# EasyEDA schematic MOSfet Switch.json
TITLE: MOSFet-Switch-B.01.00; REV: 1.0; Date: 2025-02-12; Sheet: 1/1; Drawn By: helmut-f; Company: Your Company
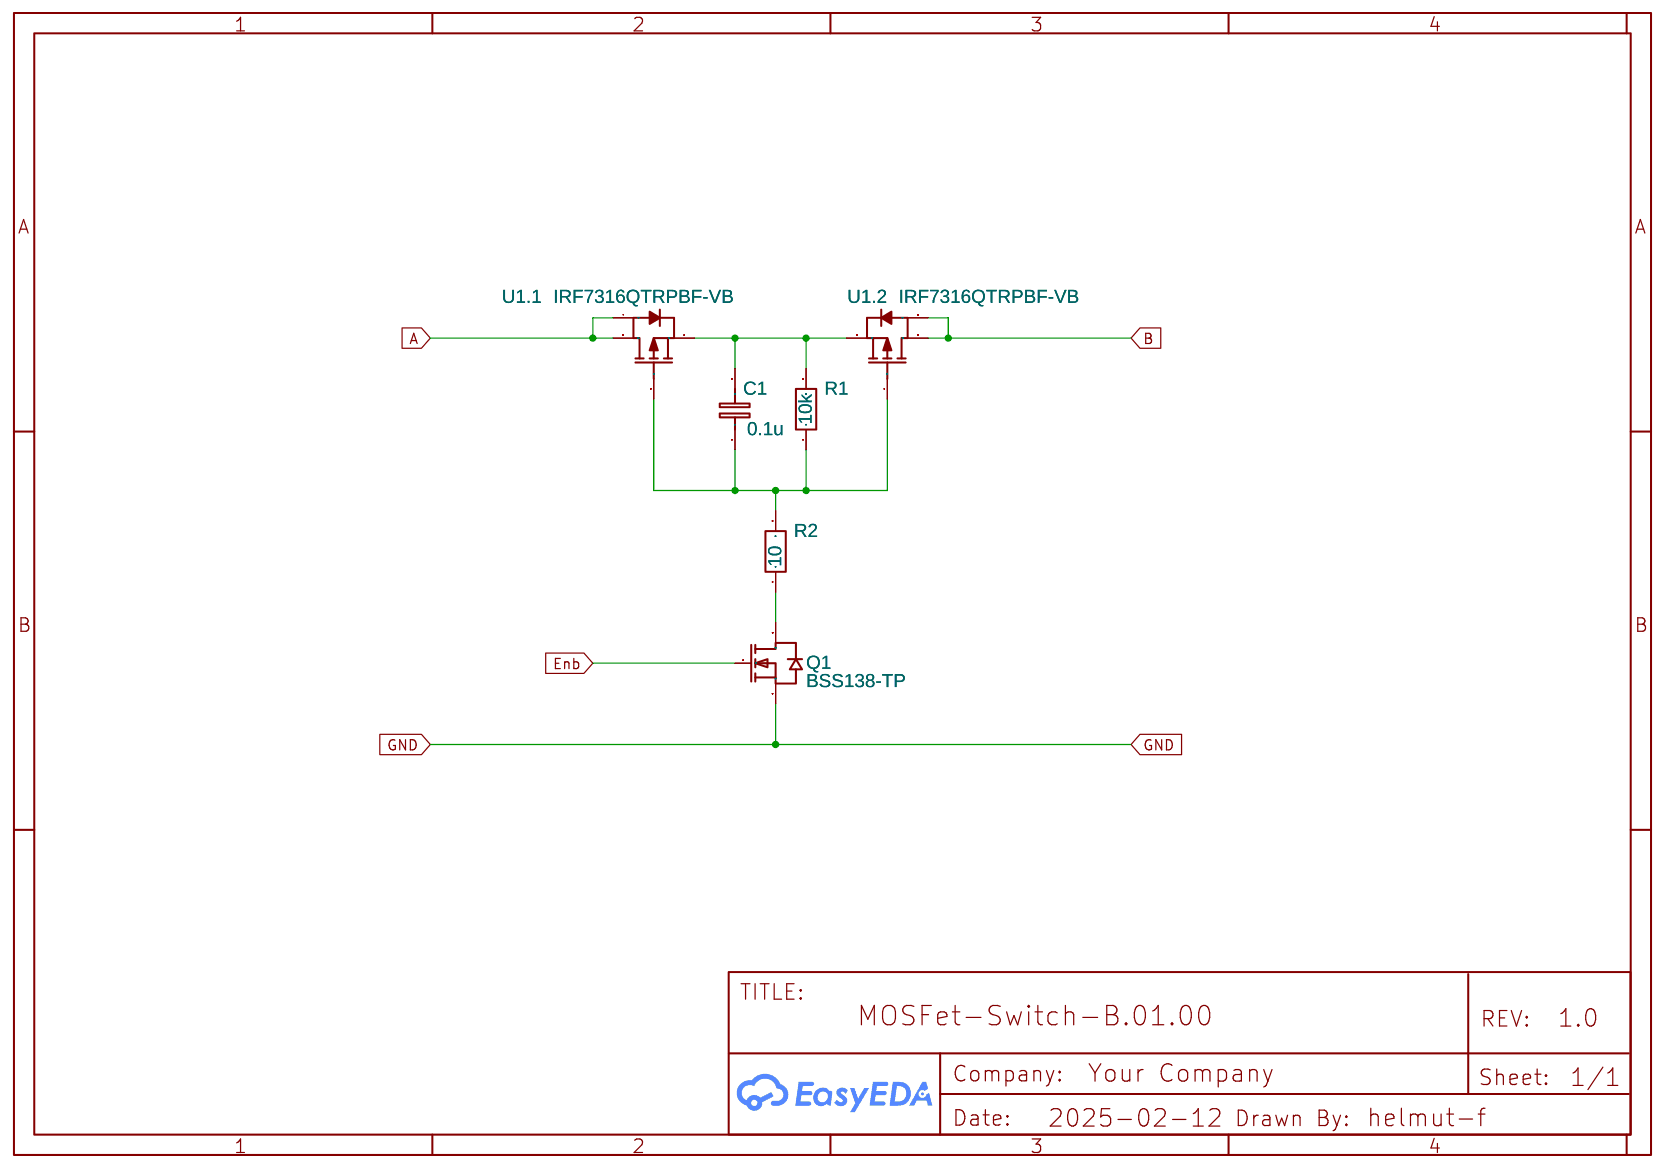
[diagram p0: schematic sheet]

## Parts
C1  0.1u  [C1206]
Q1  BSS138-TP  [SOT-23-3_L2.9-W1.3-P1.90-LS2.4-BR]
R1  10k  [R1206]
R2  10  [R1206]
U1  IRF7316QTRPBF-VB  [SOP-8_L4.9-W3.9-P1.27-LS6.0-BL]  (sections 1,2)

## Library data of the parts
C1 = C_1206_EU: Contributor: LCEDA_Lib
Q1 = BSS138-TP: Contributor: LCSC; Supplier: LCSC; Supplier Part: C435876; Manufacturer: MCC(美微科); JLCPCB Part Class: Extended Part
R1 R2 = R_1206_EU: Contributor: LCEDA_Lib
U1 = IRF7316QTRPBF-VB: Supplier: LCSC; Supplier Part: C18795001; Manufacturer: VBsemi(微碧半导体); subpart_no: 1; JLCPCB Part Class: Extended Part

## Nets
GND: Q1.2(S)
A: U1.7(D1) U1.8(D1)
B: U1.5(D2) U1.6(D2)
Enb: Q1.1(G)
Net-(C1-1): C1.1 R1.1 R2.2 U1.2(G1) U1.4(G2)
Net-(C1-2): C1.2 R1.2 U1.1(S1) U1.3(S2)
Net-(Q1-3): Q1.3(D) R2.1
